# Altium schematic sheet Gavrilov1.SchDoc
size 209 x 297 mm; CheckedBy: Рахматулин; Author: Гаврилов; Organization: МИФИ; SheetNumber: 1; SheetTotal: 1; PageSetup: Record=PageOptions|CenterHorizontal=True|CenterVertical=True|PrintScale=0.94|XCorrection=1.00|YCorrection=1.00|PrintKind=1|BorderSize=5000000|LeftOffset=0|BottomOffset=0|Orientation=1|PaperLength=1000|PaperWidth=1000|Scale=100|PaperSource=7|PrintQuality=-4|MediaType=1|DitherType=10|PaperKind=A4|PrintScaleMode=1; DecimalNumber: МКБА.025.16.00.000; HeadOfSector: Нач. сектора; MainDevice: Перв.примен.; Name1: преобразователь; t_kontr: Т. Контр; n_kontr: Н. Контр; lit_A: У; Name2: сигнала датчика
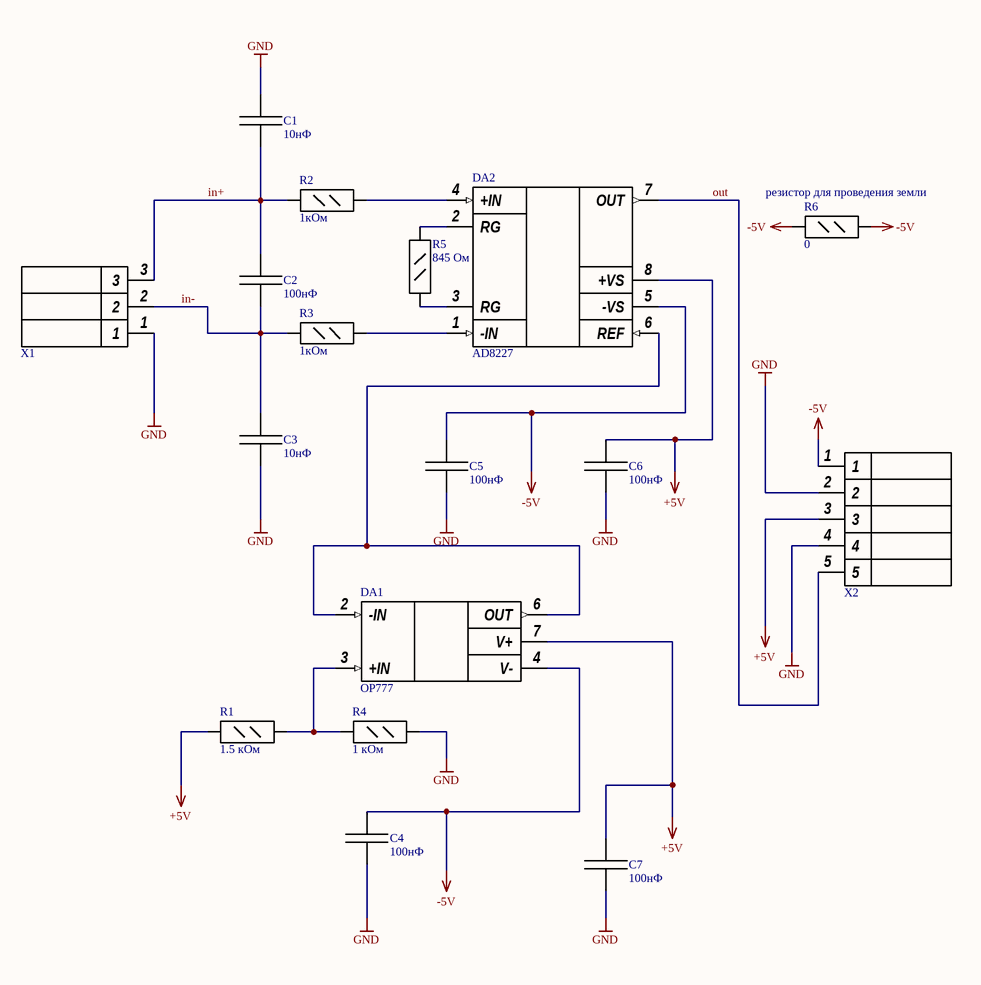
[diagram p0: Gavrilov1.SchDoc]

## Parts
C1  10нФ  [CAPC2012L-С0805]
C2  100нФ  [CAPC2012L-С0805]
C3  10нФ  [CAPC2012L-С0805]
C4  100нФ  [CAPC2012L-С0805]
C5  100нФ  [CAPC2012L-С0805]
C6  100нФ  [CAPC2012L-С0805]
C7  100нФ  [CAPC2012L-С0805]
DA1  OP777  [SOIC127P600-8BM]
DA2  AD8227  [SO-8_L]
R1  1.5 кОм  [RESC2012N]
R2  1кОм  [RESC2012N]
R3  1кОм  [RESC2012N]
R4  1 кОм  [RESC2012N]
R5  845 Ом  [RESC2012N]
R6  0  [RESC2012N]
X1  KLEMMNIK3  [KL3]  (value not drawn)
X2  KLEMMNIK5  [KLEMNIK5]  (value not drawn)

## Nets
+5V: C6.2 C7.2 DA1.7(V+) DA2.8(+VS) R1.1 X2.3
-5V: C4.2 C5.2 DA1.4(V-) DA2.5(-VS) R6.1 R6.2 X2.1
GND: C1.2 C3.1 C4.1 C5.1 C6.1 C7.1 R4.2 X1.1 X2.2 X2.4
in+: C1.1 C2.2 R2.1 X1.3
in-: C2.1 C3.2 R3.1 X1.2
out: DA2.7(OUT) X2.5
NetDA1_2: DA1.2(-IN) DA1.6(OUT) DA2.6(REF)
NetDA1_3: DA1.3(+IN) R1.2 R4.1
NetDA2_1: DA2.1(-IN) R3.2
NetDA2_2: DA2.2(RG) R5.2
NetDA2_3: DA2.3(RG) R5.1
NetDA2_4: DA2.4(+IN) R2.2

## Notes on the sheet
- (near R6) резистор для проведения земли
- Перв.примен.
- Справ.№
- Подп. и дата
- Инв.№ дубл.
- Взам.инв.№
- Подп.и дата
- Разраб.
- Изм.
- Лист
- № докум.
- Подп.
- Дата
- Лит.
- Масштаб
- Масса
- Т.контр.
- Пров.
- СХЕМА   ЭЛЕКТРИЧЕСКАЯ
- ПРИНЦИПИАЛЬНАЯ
- Листов
- Инв.№ подл.
- Утв.
- Н.контр.
- Нач.сект.

## Library data of the parts
C1-C7 = C0805: планарный конденсатор; Value: 0,1 мкФ
DA1 = OP777: Precision Micropower  Single-Supply Operational Amplifiers
DA2 = AD8227: instrumentation amplifier
R1 R4 R5 = R0805: планарный резистор; Value: 1кОм
R2 R3 = R0805: планарный резистор; Value: 1кОм
R6 = R0805: планарный резистор; Value: 0 Ом